# Altium schematic sheet PIC32MX.SchDoc
size A3; SheetNumber: 2; SheetTotal: 8
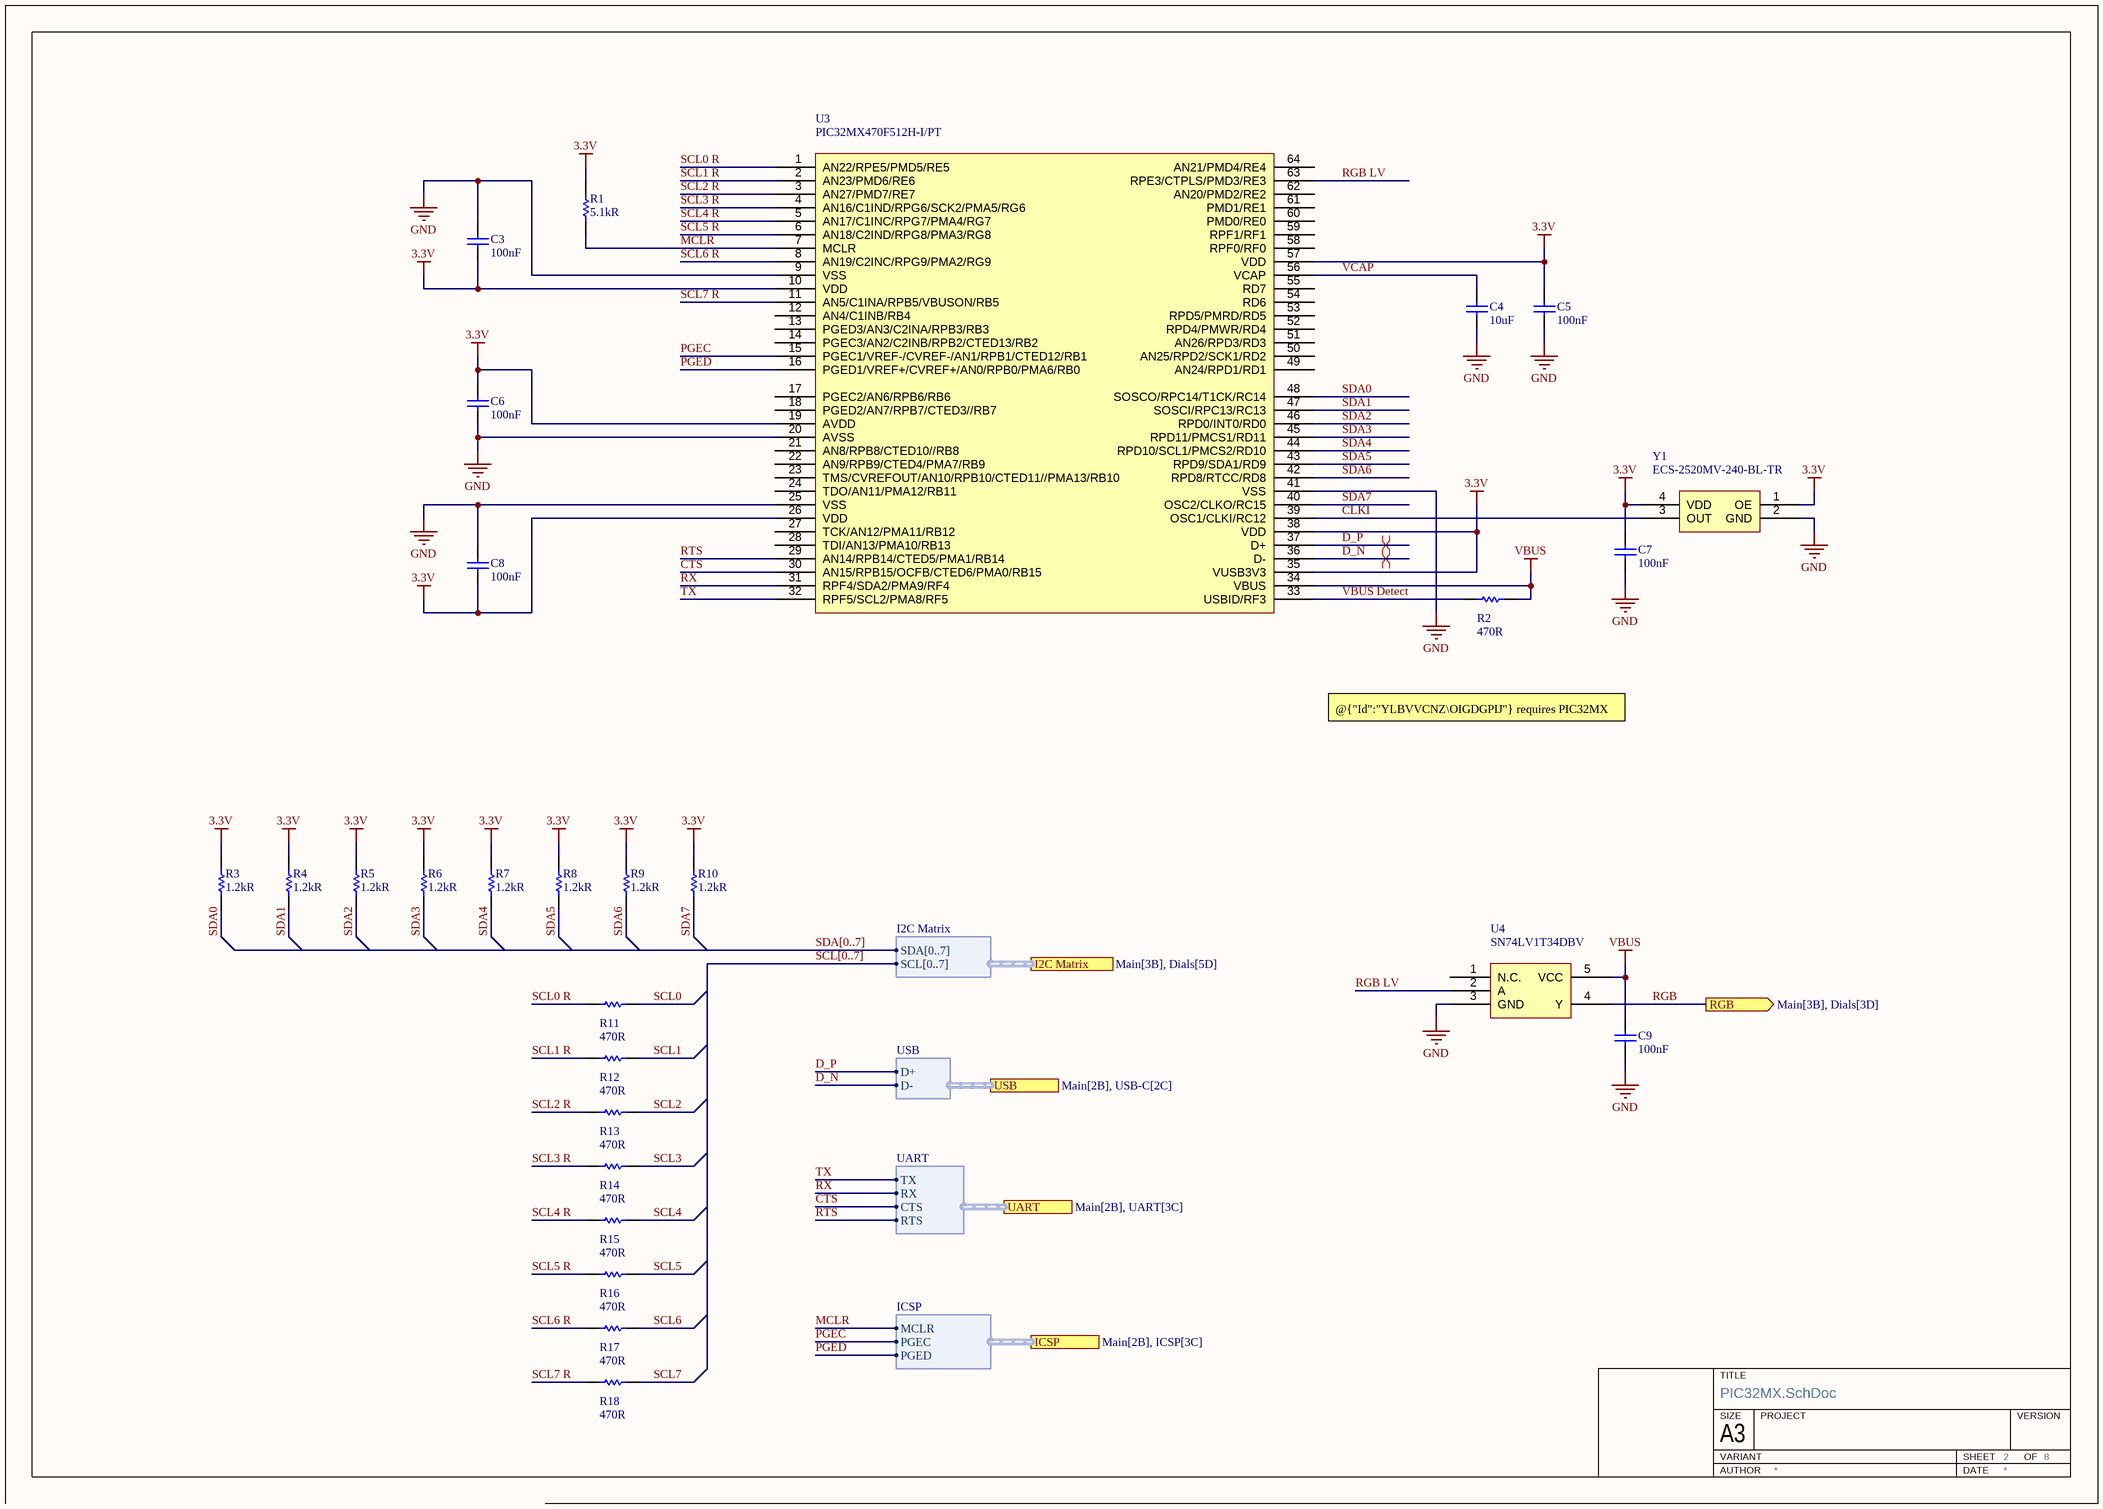
[diagram p0: PIC32MX.SchDoc]

## Parts
C3  100nF  [Capacitor 0603]
C4  10uF  [Capacitor 0603]
C5  100nF  [Capacitor 0603]
C6  100nF  [Capacitor 0603]
C7  100nF  [Capacitor 0603]
C8  100nF  [Capacitor 0603]
C9  100nF  [Capacitor 0603]
R1  5.1kR  [Resistor 0603]
R2  470R  [Resistor 0603]
R3  1.2kR  [Resistor 0603]
R4  1.2kR  [Resistor 0603]
R5  1.2kR  [Resistor 0603]
R6  1.2kR  [Resistor 0603]
R7  1.2kR  [Resistor 0603]
R8  1.2kR  [Resistor 0603]
R9  1.2kR  [Resistor 0603]
R10  1.2kR  [Resistor 0603]
R11  470R  [Resistor 0603]
R12  470R  [Resistor 0603]
R13  470R  [Resistor 0603]
R14  470R  [Resistor 0603]
R15  470R  [Resistor 0603]
R16  470R  [Resistor 0603]
R17  470R  [Resistor 0603]
R18  470R  [Resistor 0603]
U3  PIC32MX470F512H-I/PT  [TQFP-64]
U4  SN74LV1T34DBV  [SOT-23-5]
Y1  ECS-2520MV-240-BL-TR  [ECS-2520MV-240-BL-TR]

## Ports
I2C Matrix (harness I2C Matrix, see Main[3B], Dials[5D]), ICSP (harness ICSP, see Main[2B], ICSP[3C]), RGB (out, see Main[3B], Dials[3D]), UART (harness UART, see Main[2B], UART[3C]), USB (harness USB, see Main[2B], USB-C[2C])

## Harnesses
I2C Matrix: SDA[0..7], SCL[0..7]
USB: D+, D-
ICSP: MCLR, PGEC, PGED
UART: TX, RX, CTS, RTS

## Nets
3.3V: C3.1 C5.2 C6.2 C7.2 C8.1 R1.2 R3.2 R4.2 R5.2 R6.2 R7.2 R8.2 R9.2 R10.2 U3.10(VDD) U3.19(AVDD) U3.26(VDD) U3.35(VUSB3V3) U3.38(VDD) U3.57(VDD) Y1.1(OE) Y1.4(VDD)
GND: C3.2 C4.1 C5.1 C6.1 C7.1 C8.2 C9.1 U3.9(VSS) U3.20(AVSS) U3.25(VSS) U3.41(VSS) U4.3(GND) Y1.2(GND)
VBUS: C9.2 R2.2 U3.34(VBUS) U4.5(VCC)
CLKI: U3.39(OSC1/CLKI/RC12) Y1.3(OUT)
CTS: U3.30(AN15/RPB15/OCFB/CTED6/PMA0/RB15) ; port UART.CTS
D_N: U3.36(D-) ; port USB.D-
D_P: U3.37(D+) ; port USB.D+
MCLR: R1.1 U3.7(MCLR) ; port ICSP.MCLR
PGEC: U3.15(PGEC1/VREF-/CVREF-/AN1/RPB1/CTED12/RB1) ; port ICSP.PGEC
PGED: U3.16(PGED1/VREF+/CVREF+/AN0/RPB0/PMA6/RB0) ; port ICSP.PGED
RGB: U4.4(Y) ; port RGB
RGB LV: U3.63(RPE3/CTPLS/PMD3/RE3) U4.2(A)
RTS: U3.29(AN14/RPB14/CTED5/PMA1/RB14) ; port UART.RTS
RX: U3.31(RPF4/SDA2/PMA9/RF4) ; port UART.RX
SCL0: R11.2
SCL0 R: R11.1 U3.1(AN22/RPE5/PMD5/RE5)
SCL1: R12.2
SCL1 R: R12.1 U3.2(AN23/PMD6/RE6)
SCL2: R13.2
SCL2 R: R13.1 U3.3(AN27/PMD7/RE7)
SCL3: R14.2
SCL3 R: R14.1 U3.4(AN16/C1IND/RPG6/SCK2/PMA5/RG6)
SCL4: R15.2
SCL4 R: R15.1 U3.5(AN17/C1INC/RPG7/PMA4/RG7)
SCL5: R16.2
SCL5 R: R16.1 U3.6(AN18/C2IND/RPG8/PMA3/RG8)
SCL6: R17.2
SCL6 R: R17.1 U3.8(AN19/C2INC/RPG9/PMA2/RG9)
SCL7: R18.2
SCL7 R: R18.1 U3.11(AN5/C1INA/RPB5/VBUSON/RB5)
SDA0: R3.1 U3.48(SOSCO/RPC14/T1CK/RC14)
SDA1: R4.1 U3.47(SOSCI/RPC13/RC13)
SDA2: R5.1 U3.46(RPD0/INT0/RD0)
SDA3: R6.1 U3.45(RPD11/PMCS1/RD11)
SDA4: R7.1 U3.44(RPD10/SCL1/PMCS2/RD10)
SDA5: R8.1 U3.43(RPD9/SDA1/RD9)
SDA6: R9.1 U3.42(RPD8/RTCC/RD8)
SDA7: R10.1 U3.40(OSC2/CLKO/RC15)
TX: U3.32(RPF5/SCL2/PMA8/RF5) ; port UART.TX
VBUS Detect: R2.1 U3.33(USBID/RF3)
VCAP: C4.2 U3.56(VCAP)

Not connected (* = marked no-connect by the designer): U3 12(AN4/C1INB/RB4) 13(PGED3/AN3/C2INA/RPB3/RB3) 14(PGEC3/AN2/C2INB/RPB2/CTED13/RB2) 17(PGEC2/AN6/RPB6/RB6) 18(PGED2/AN7/RPB7/CTED3//RB7) 21(AN8/RPB8/CTED10//RB8) 22(AN9/RPB9/CTED4/PMA7/RB9) 23(TMS/CVREFOUT/AN10/RPB10/CTED11//PMA13/RB10) 24(TDO/AN11/PMA12/RB11) 27(TCK/AN12/PMA11/RB12) 28(TDI/AN13/PMA10/RB13) 49(AN24/RPD1/RD1) 50(AN25/RPD2/SCK1/RD2) 51(AN26/RPD3/RD3) 52(RPD4/PMWR/RD4) 53(RPD5/PMRD/RD5) 54(RD6) 55(RD7) 58(RPF0/RF0) 59(RPF1/RF1) 60(PMD0/RE0) 61(PMD1/RE1) 62(AN20/PMD2/RE2) 64(AN21/PMD4/RE4); U4 1(N.C.)

## Buses and harness runs
bus SCL[0..7]
bus SDA[0..7]

## Layout directives
differential pair: D_N, D_P

## Notes on the sheet
- @{"Id":"YLBVVCNZ\OIGDGPIJ"} requires PIC32MX internal pull-down
- TITLE
- SIZE
- A3
- VARIANT
- PROJECT
- SHEET
- VERSION
- OF
- AUTHOR
- DATE

## Library data of the parts
C3-C9 = Capacitor
R1-R18 = Resistor
U3 = PIC32MX470F512H
U4 = SN74LVC1xxx (1 Input)
Y1 = Oscillator